# Altium schematic sheet TI_DS26C32AT.SchDoc
size A4; CompanyName: Technische Hochschule Nürnberg Georg Simon Ohm; Address1: Fürther Straße 250; Address2: 90429 Nürnberg; Address3: GERMANY; DocumentNumber: 9; SheetNumber: 9; SheetTotal: 16; CompanyName2: Institut ELSYS
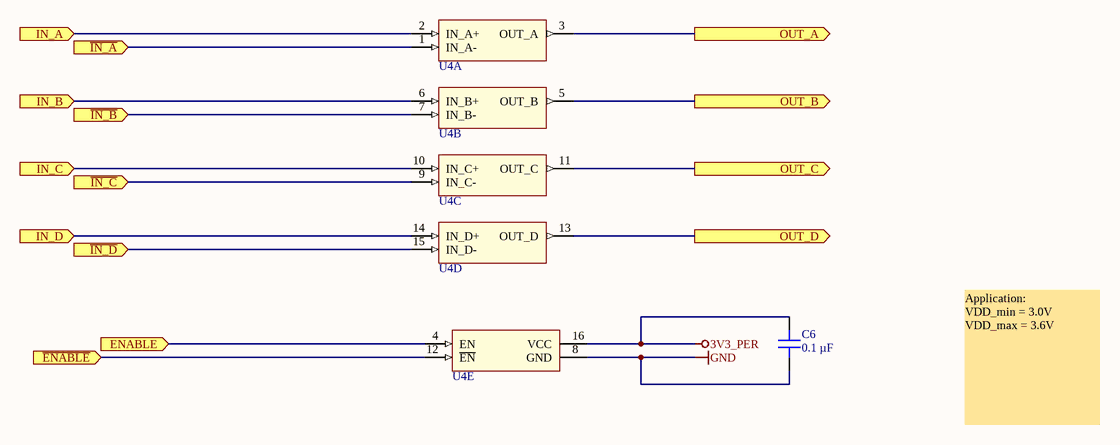
[diagram p0: TI_DS26C32AT.SchDoc]

## Parts
C6  0.1 µF  [C_0603]
U4  DS26LV32ATM/NOPB  [TI_D-R-PDSO-G16_N]  (value not drawn)  (parts A,B,C,D,E of 5)

## Ports
ENABLE (in), IN_A (in), IN_B (in), IN_C (in), IN_D (in), OUT_A (out), OUT_B (out), OUT_C (out), OUT_D (out), ~{ENABLE} (in), ~{IN_A} (in), ~{IN_B} (in), ~{IN_C} (in), ~{IN_D} (in)

## Nets
3V3_PER: C6.2 U4.16(VCC)
GND: C6.1 U4.8(GND)
~{ENABLE}: U4.12(~{EN}) ; port ~{ENABLE}
ENABLE: U4.4(EN) ; port ENABLE
~{IN_A}: U4.1(IN_A-) ; port ~{IN_A}
~{IN_B}: U4.7(IN_B-) ; port ~{IN_B}
~{IN_C}: U4.9(IN_C-) ; port ~{IN_C}
~{IN_D}: U4.15(IN_D-) ; port ~{IN_D}
IN_A: U4.2(IN_A+) ; port IN_A
IN_B: U4.6(IN_B+) ; port IN_B
IN_C: U4.10(IN_C+) ; port IN_C
IN_D: U4.14(IN_D+) ; port IN_D
OUT_A: U4.3(OUT_A) ; port OUT_A
OUT_B: U4.5(OUT_B) ; port OUT_B
OUT_C: U4.11(OUT_C) ; port OUT_C
OUT_D: U4.13(OUT_D) ; port OUT_D

## Notes on the sheet
- Application:
  VDD_min = 3.0V
  VDD_max = 3.6V
- Title
- Size:
- Date:
- A4
- Revision:
- Time:
- Sheet
- of
- Author:
- Project:

## Library data of the parts
C6 = C0603X104K5RAC7411: Capacitor 0603, 50 VDC, 0.1 µF, X7R; Manufacturer: KEMET; Tolerance: 10 %; Voltage Rating: 50 VDC; Created from: MGremer; Manufacturer Part Number: C0603X104K5RAC7411; PartID: 3; Created On: 20.12.2020 13:54:13; ComponentLink1Description: Datasheet; ComponentLink1URL: https://www.mouser.de/datasheet/2/212/1/KEM_C1013_X7R_FT_CAP_SMD-1103280.pdf; Component Type: Capacitor 0603; Device Package: 0603; Last Updated: 04.03.2021 09:24:28; Mounting Type: SMD; Operating Temperature: -55 - 125°C; Series: SMD Comm X7R Flex; Supplier 1: Mouser; Supplier Part Number 1: 80-C0603X104K5R7411; Type: Capacitor; Value: 0.1 µF; Live Cycle Status: 1; Stock number: Labor SMD Container; LCSC Part Number: C14663; Supplier 2: LCSC; Supplier Part Number 2: C14663
U4 = DS26LV32ATM/NOPB: 3V Enhanced CMOS Quad Differential Line Receiver, 16-pin Narrow SOIC, Pb-Free; Manufacturer: Texas Instruments; Created from: T. Wendt; PartID: 2; Created On: 01.03.2021 10:35:45; ComponentLink1Description: Datasheet; ComponentLink1URL: http://www.ti.com/general/docs/lit/getliterature.tsp?genericPartNumber=DS26LV32AT&fileType=pdf; Component Type: RS422 Receiver; Device Package: SOIC; Last Updated: 04.03.2021 09:04:43; Manufacturer Part Number: DS26LV32ATM/NOPB; Minimum Order: 1; Mounting Type: SMD; Operating Temperature: -40°C - 85°C; Series: DS26LV32; Supplier 1: Mouser; Supplier Part Number 1: 926-DS26LV32ATM/NOPB; Supplier 2: Mouser; Supplier Part Number 2: 926-DS26LV32ATMXNOPB; Type: Standard; Live Cycle Status: 1; LCSC Part Number: C59861; Stock number: not stored; Supplier 3: LCSC; Supplier Part Number 3: C59861